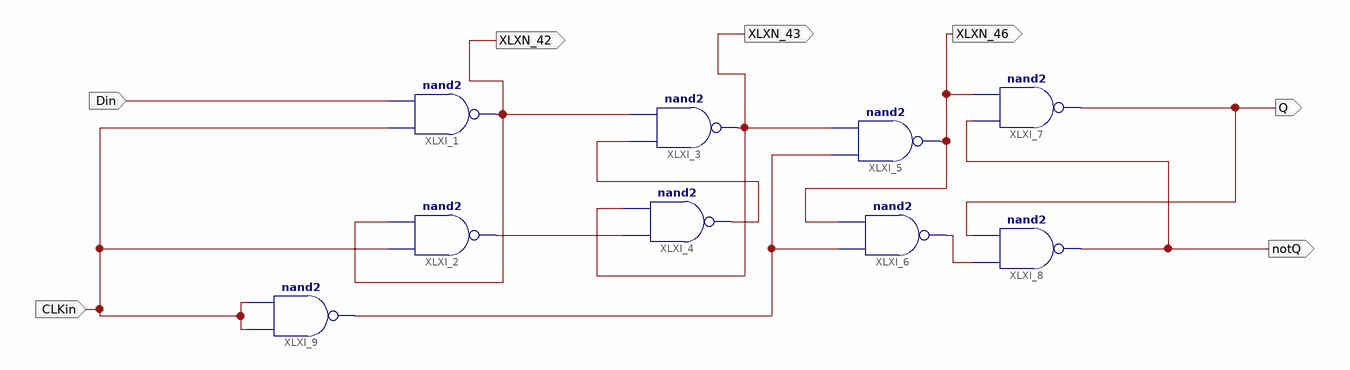
[diagram p0: schematic sheet 1]
// Xilinx ISE schematic NegativeEdgeTriggered_DFF.sch (spartan3e) as structural Verilog: 9 symbols, 7 ports
module NegativeEdgeTriggered_DFF (
  input  Din,
  input  CLKin,
  output Q,
  output notQ,
  output XLXN_42,
  output XLXN_43,
  output XLXN_46
);

  wire XLXN_2, XLXN_3, XLXN_13, XLXN_15;

  nand XLXI_1 (XLXN_42, CLKin, Din);
  nand XLXI_2 (XLXN_2, CLKin, XLXN_42);
  nand XLXI_3 (XLXN_43, XLXN_3, XLXN_42);
  nand XLXI_4 (XLXN_3, XLXN_2, XLXN_43);
  nand XLXI_5 (XLXN_46, XLXN_13, XLXN_43);
  nand XLXI_6 (XLXN_15, XLXN_13, XLXN_46);
  nand XLXI_7 (Q, notQ, XLXN_46);
  nand XLXI_8 (notQ, XLXN_15, Q);
  nand XLXI_9 (XLXN_13, CLKin, CLKin);
endmodule
